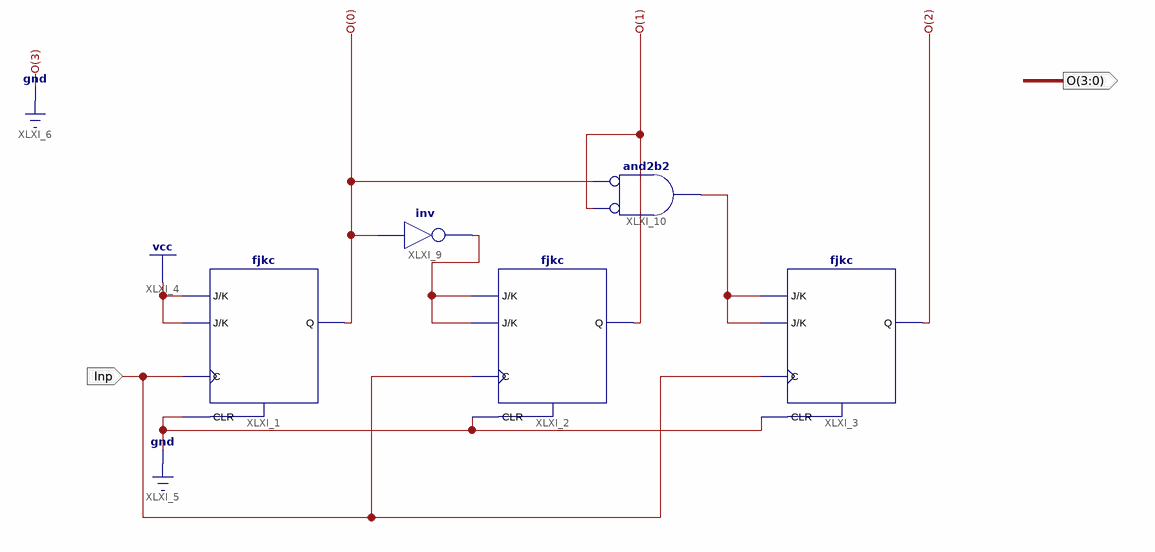
[diagram p0: schematic sheet 1]
// Xilinx ISE schematic counter7_0.sch (spartan6) as structural Verilog: 5 symbols, 2 ports
module counter7_0 (
  input  Inp,
  output [3:0] O
);

  wire XLXN_11, XLXN_18;

  fjkc XLXI_1 (.C(Inp), .CLR(1'b0), .J(1'b1), .K(1'b1), .Q(O[0]));
  fjkc XLXI_3 (.C(Inp), .CLR(1'b0), .J(XLXN_11), .K(XLXN_11), .Q(O[2]));
  fjkc XLXI_2 (.C(Inp), .CLR(1'b0), .J(XLXN_18), .K(XLXN_18), .Q(O[1]));
  not XLXI_9 (XLXN_18, O[0]);
  and XLXI_10 (XLXN_11, ~O[1], ~O[0]);  // and2b2

  assign O[3] = 1'b0;
endmodule
